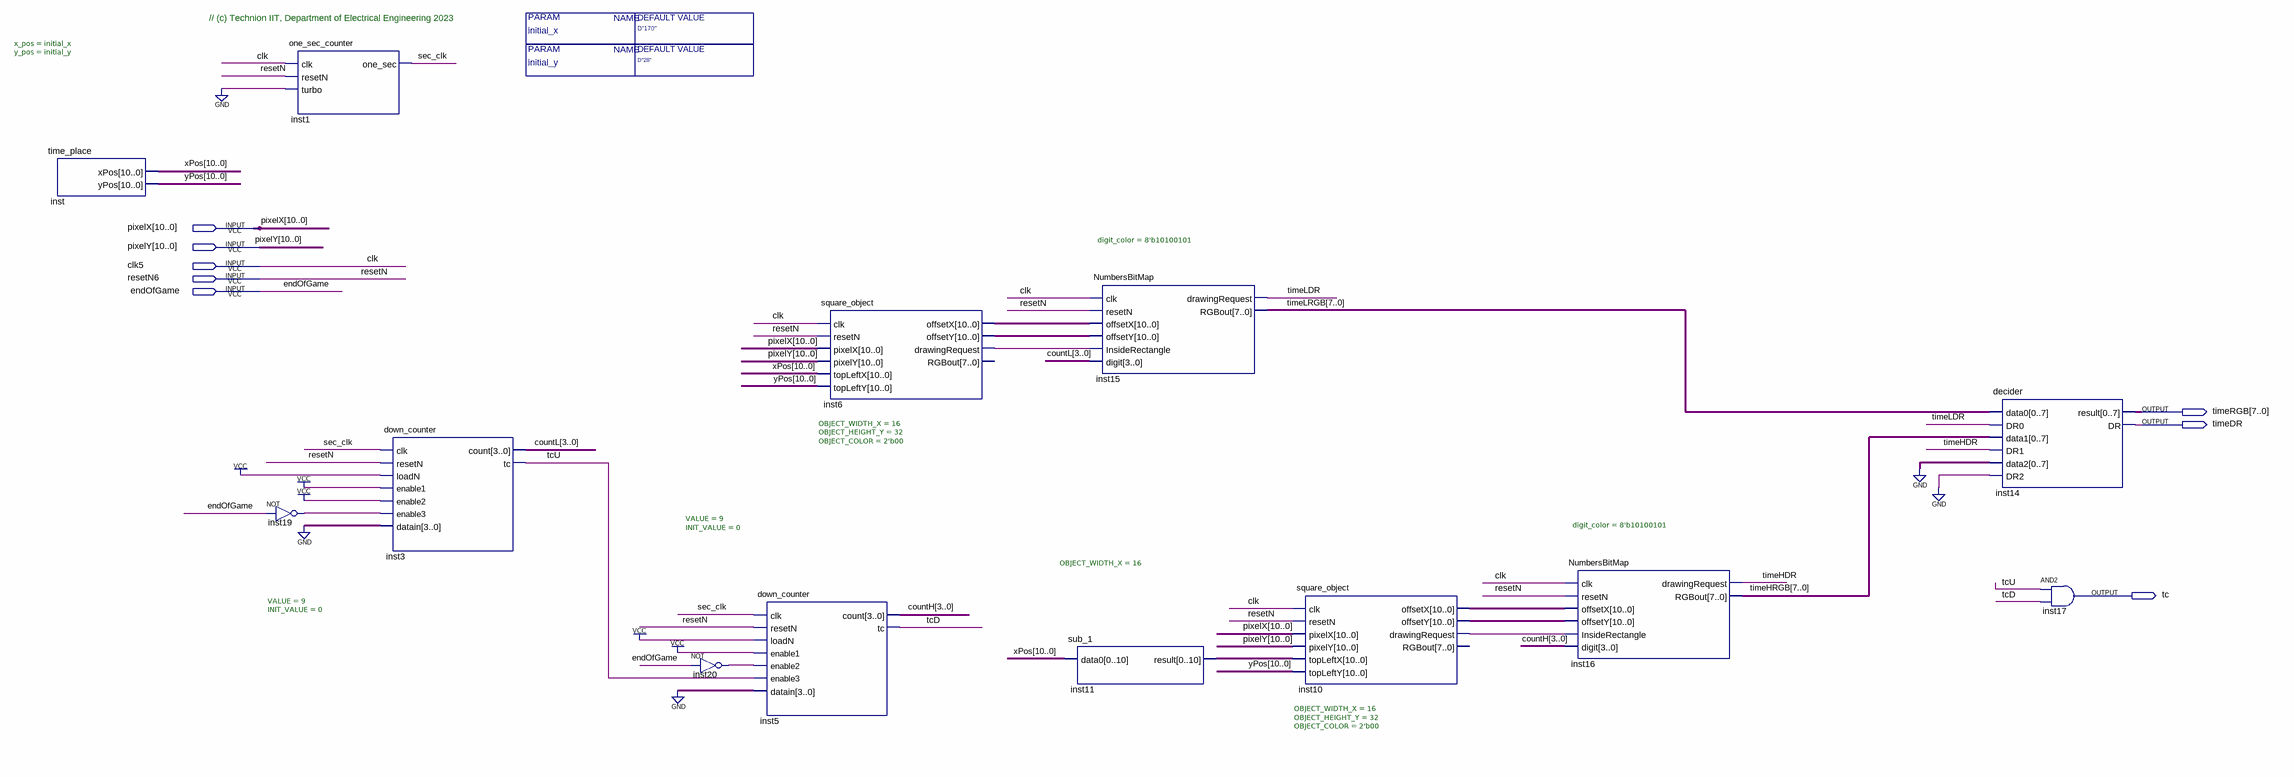
[diagram p0: schematic sheet]
// Quartus schematic time_Block_T.bdf as structural Verilog: 13 symbols, 8 pins
module time_Block_T #(parameter initial_x = "D\"170\"", parameter initial_y = "D\"28\"") (
  input  [10:0] pixelX,
  input  [10:0] pixelY,
  input  clk5,
  input  resetN6,
  input  endOfGame,
  output [7:0] timeRGB,
  output timeDR,
  output tc
);

  wire inst6_drawingrequest, inst10_drawingrequest, inst19_out, inst20_out, sec_clk, tcD, tcU, timeHDR,
       timeLDR;
  wire [3:0] countH, countL;
  wire [7:0] timeHRGB, timeLRGB;
  wire [10:0] inst6_offsetx, inst6_offsety, inst10_offsetx, inst10_offsety, inst11_result, xPos, yPos;

  time_place #(.x_pos(initial_x), .y_pos(initial_y)) inst (.xPos(xPos), .yPos(yPos));
  not inst19 (inst19_out, endOfGame);
  one_sec_counter inst1 (.clk(clk5), .resetN(resetN6), .turbo(1'b0), .one_sec(sec_clk));
  down_counter #(.VALUE(9), .INIT_VALUE(0)) inst3 (
    .clk(sec_clk), .resetN(resetN6), .loadN(1'b1), .enable1(1'b1), .enable2(1'b1), .enable3(inst19_out),
    .datain(4'b0000), .count(countL), .tc(tcU));
  not inst20 (inst20_out, endOfGame);
  down_counter #(.VALUE(9), .INIT_VALUE(0)) inst5 (
    .clk(sec_clk), .resetN(resetN6), .loadN(1'b1), .enable1(1'b1), .enable2(inst20_out), .enable3(tcU),
    .datain(4'b0000), .count(countH), .tc(tcD));
  square_object #(.OBJECT_WIDTH_X(16), .OBJECT_HEIGHT_Y(32), .OBJECT_COLOR(2'b00)) inst6 (
    .clk(clk5), .resetN(resetN6), .pixelX(pixelX), .pixelY(pixelY), .topLeftX(xPos), .topLeftY(yPos),
    .offsetX(inst6_offsetx), .offsetY(inst6_offsety), .drawingRequest(inst6_drawingrequest));  // open: RGBout
  sub_1 #(.OBJECT_WIDTH_X(16)) inst11 (.data0(xPos), .result(inst11_result));
  NumbersBitMap #(.digit_color(8'b10100101)) inst15 (
    .clk(clk5), .resetN(resetN6), .offsetX(inst6_offsetx), .offsetY(inst6_offsety),
    .InsideRectangle(inst6_drawingrequest), .digit(countL), .drawingRequest(timeLDR), .RGBout(timeLRGB));
  square_object #(.OBJECT_WIDTH_X(16), .OBJECT_HEIGHT_Y(32), .OBJECT_COLOR(2'b00)) inst10 (
    .clk(clk5), .resetN(resetN6), .pixelX(pixelX), .pixelY(pixelY), .topLeftX(inst11_result),
    .topLeftY(yPos), .offsetX(inst10_offsetx), .offsetY(inst10_offsety),
    .drawingRequest(inst10_drawingrequest));  // open: RGBout
  NumbersBitMap #(.digit_color(8'b10100101)) inst16 (
    .clk(clk5), .resetN(resetN6), .offsetX(inst10_offsetx), .offsetY(inst10_offsety),
    .InsideRectangle(inst10_drawingrequest), .digit(countH), .drawingRequest(timeHDR), .RGBout(timeHRGB));
  decider inst14 (
    .data0(timeLRGB), .DR0(timeLDR), .data1(timeHRGB), .DR1(timeHDR), .data2({8{1'b0}}), .DR2(1'b0),
    .result(timeRGB), .DR(timeDR));
  and inst17 (tc, tcU, tcD);

  // Other names for the same wires on the sheet: clk = clk5; resetN = resetN6

  // Notes on the sheet:
  //   // (c) Technion IIT, Department of Electrical Engineering 2023
endmodule
